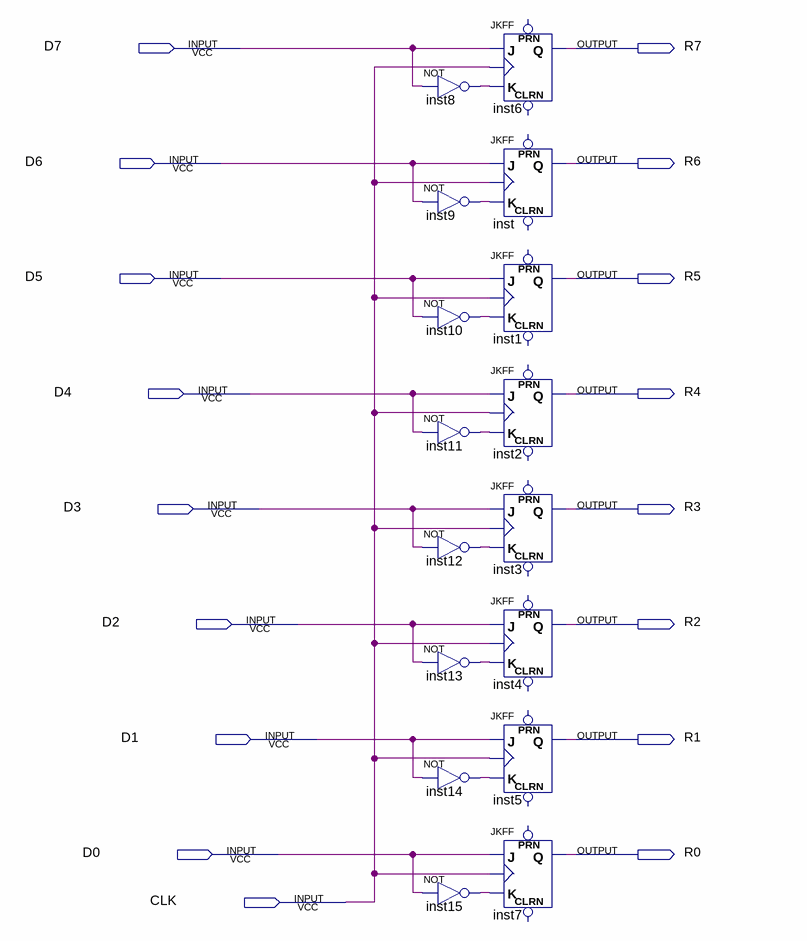
[diagram p0: schematic sheet]
// Quartus schematic registrador8bits.bdf as structural Verilog: 16 symbols, 17 pins
module registrador8bits (
  input  D7,
  input  D6,
  input  D5,
  input  D4,
  input  D3,
  input  D2,
  input  D1,
  input  D0,
  input  CLK,
  output R7,
  output R6,
  output R5,
  output R4,
  output R3,
  output R2,
  output R1,
  output R0
);

  wire inst8_out, inst9_out, inst10_out, inst11_out, inst12_out, inst13_out, inst14_out, inst15_out;

  not inst8 (inst8_out, D7);
  not inst9 (inst9_out, D6);
  not inst10 (inst10_out, D5);
  not inst11 (inst11_out, D4);
  not inst12 (inst12_out, D3);
  not inst13 (inst13_out, D2);
  not inst14 (inst14_out, D1);
  not inst15 (inst15_out, D0);
  JKFF inst6 (.K(inst8_out), .J(D7), .CLK(CLK), .Q(R7));  // open: PRN, CLRN
  JKFF inst (.K(inst9_out), .J(D6), .CLK(CLK), .Q(R6));  // open: PRN, CLRN
  JKFF inst1 (.K(inst10_out), .J(D5), .CLK(CLK), .Q(R5));  // open: PRN, CLRN
  JKFF inst2 (.K(inst11_out), .J(D4), .CLK(CLK), .Q(R4));  // open: PRN, CLRN
  JKFF inst3 (.K(inst12_out), .J(D3), .CLK(CLK), .Q(R3));  // open: PRN, CLRN
  JKFF inst4 (.K(inst13_out), .J(D2), .CLK(CLK), .Q(R2));  // open: PRN, CLRN
  JKFF inst5 (.K(inst14_out), .J(D1), .CLK(CLK), .Q(R1));  // open: PRN, CLRN
  JKFF inst7 (.K(inst15_out), .J(D0), .CLK(CLK), .Q(R0));  // open: PRN, CLRN
endmodule
